# Altium schematic sheet MCU.SchDoc
size A3
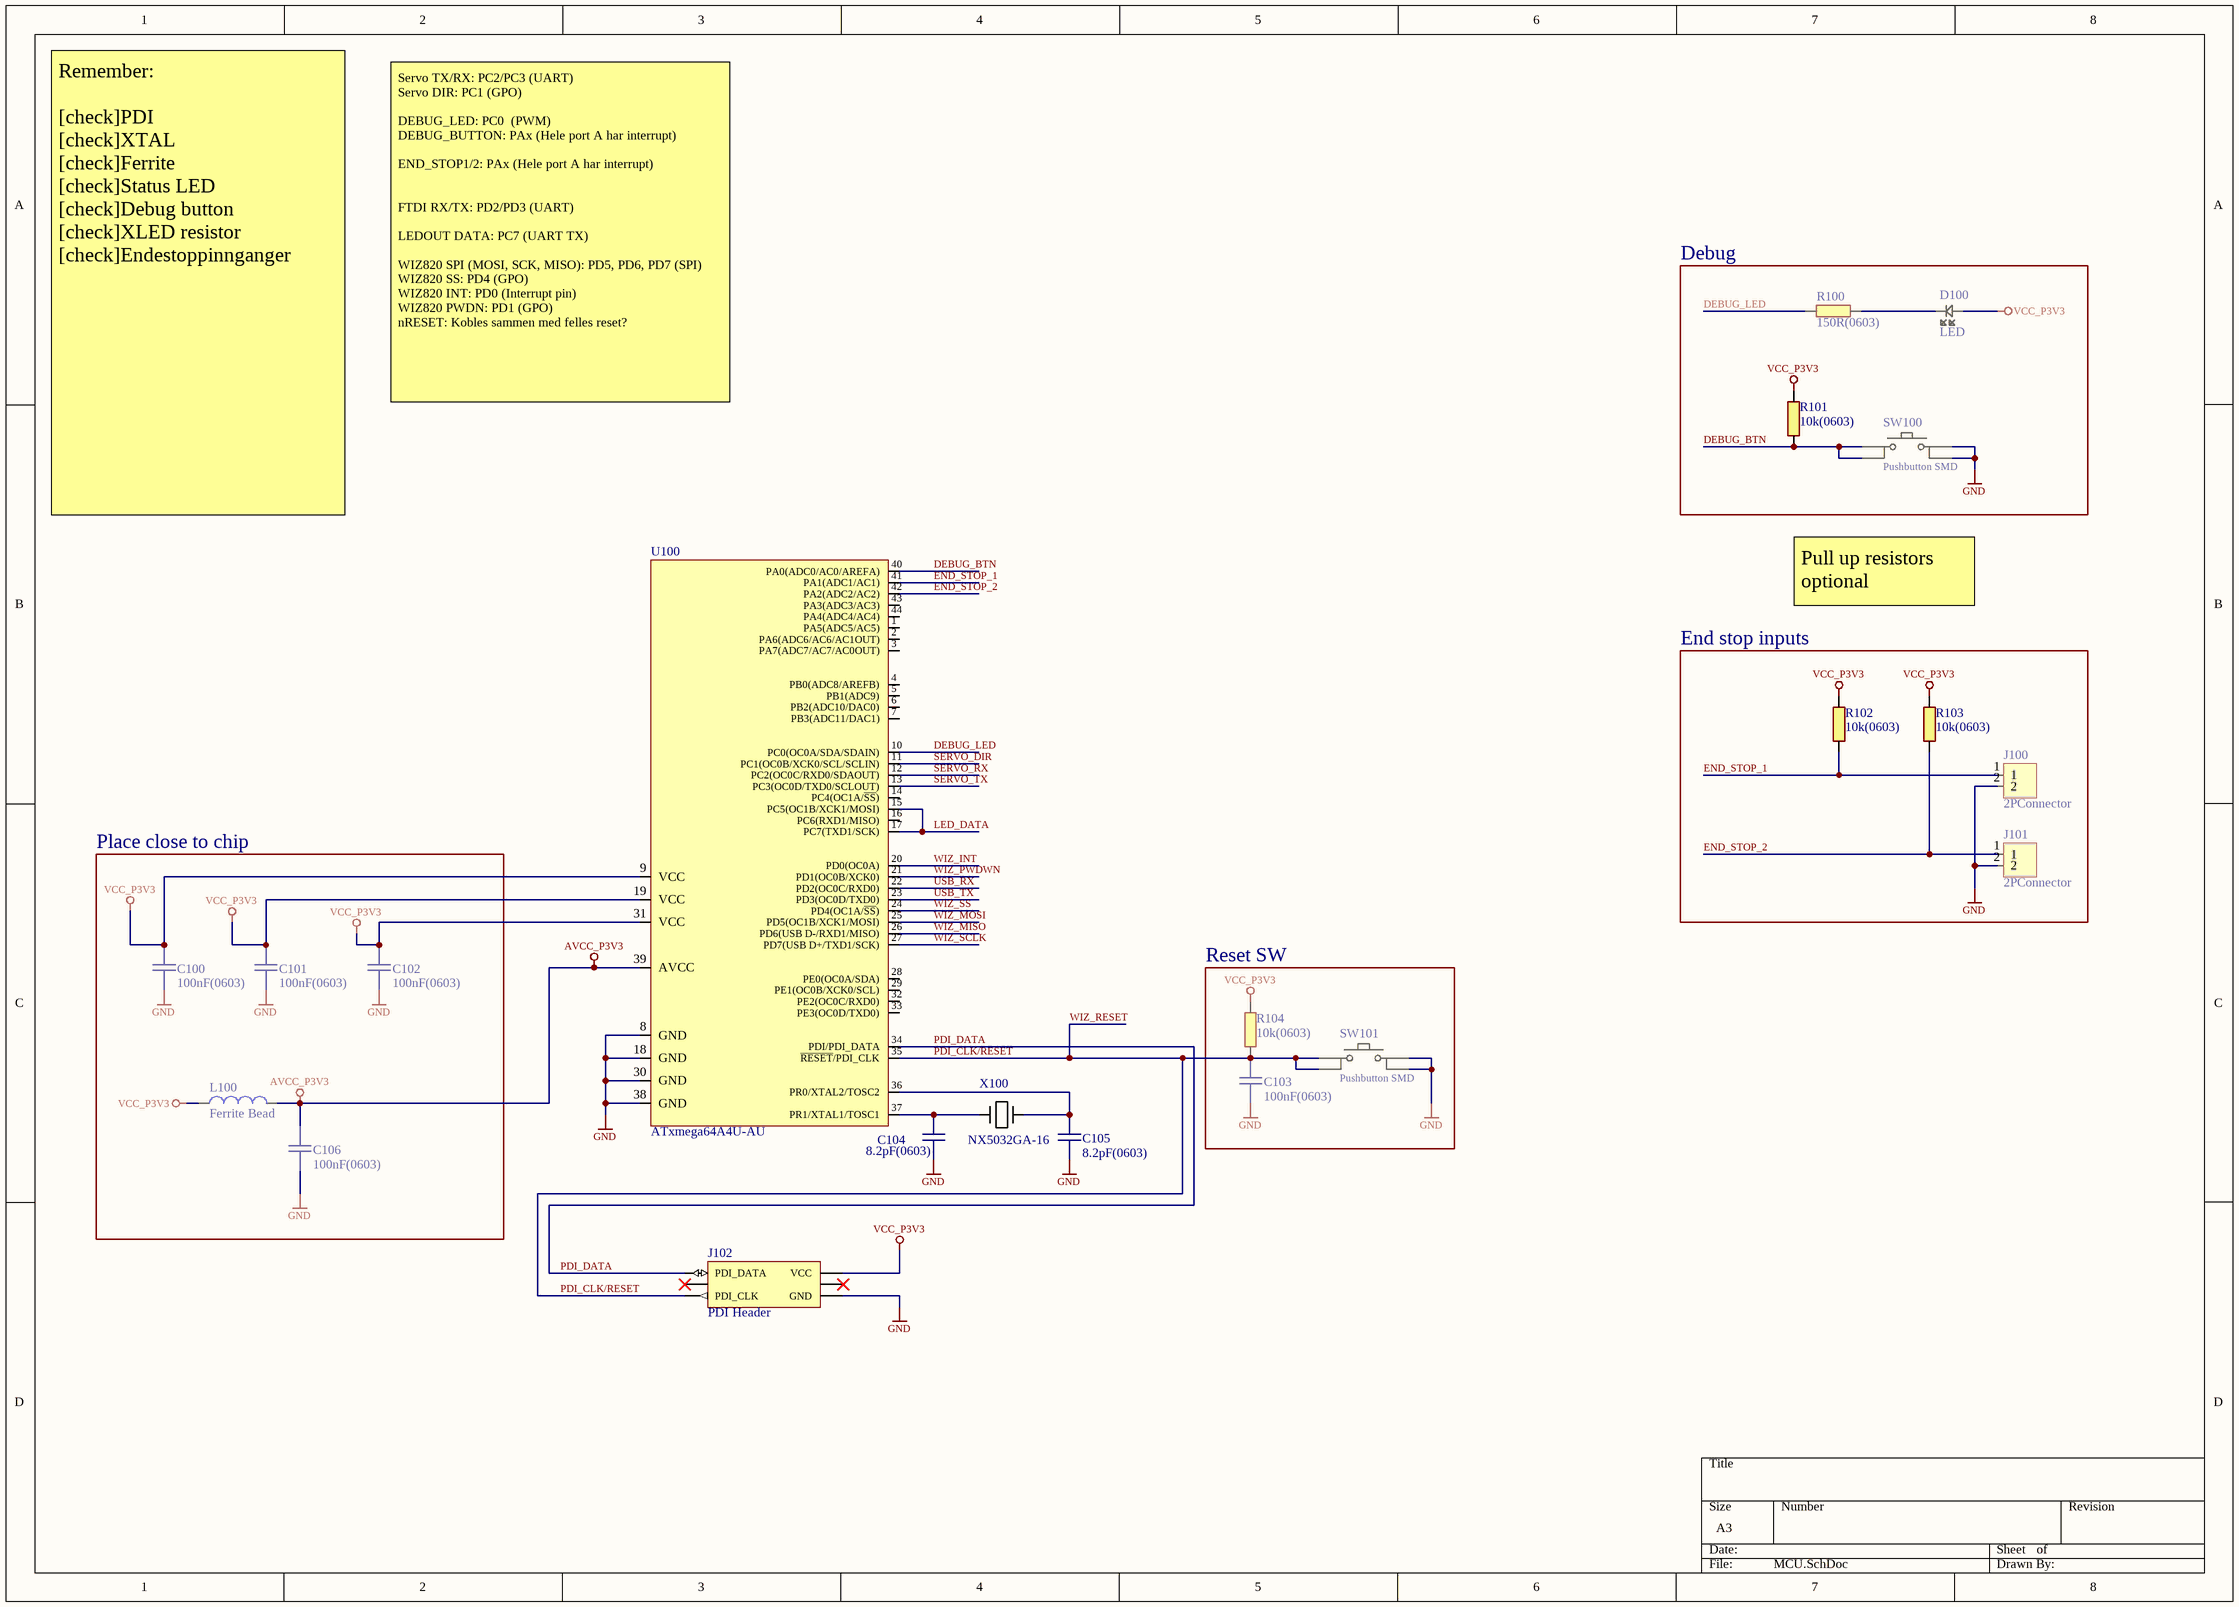
[diagram p0: MCU.SchDoc]

## Parts
C100  100nF(0603)  [CAPC0603(1608)55_N]
C101  100nF(0603)  [CAPC0603(1608)55_N]
C102  100nF(0603)  [CAPC0603(1608)55_N]
C103  100nF(0603)  [CAPC0603(1608)55_N]
C104  8.2pF(0603)  [CAPC0603(1608)55_N]
C105  8.2pF(0603)  [CAPC0603(1608)55_N]
C106  100nF(0603)  [CAPC0603(1608)55_N]
D100  LED  [I_LEDC0603(1608)_N]
J100  2PConnector  [JST_2P]
J101  2PConnector  [JST_2P]
J102  PDI Header  [HEADER_3x2]
L100  Ferrite Bead  [0603]
R100  150R(0603)  [RESC0603(1608)_N]
R101  10k(0603)  [RESC0603(1608)_N]
R102  10k(0603)  [RESC0603(1608)_N]
R103  10k(0603)  [RESC0603(1608)_N]
R104  10k(0603)  [RESC0603(1608)_N]
SW100  Pushbutton SMD  [SOIC254P500X160-4]
SW101  Pushbutton SMD  [SOIC254P500X160-4]
U100  ATxmega64A4U-AU  [44A_N]
X100  NX5032GA-16  [CRYSTAL-ABM7]

## Blocks framed on the sheet
Debug: D100 R100 R101 SW100
End stop inputs: J100 J101 R102 R103
Place close to chip: C100-C102 C106 L100
Reset SW: C103 R104 SW101

## Nets
AVCC_P3V3: C106.2 L100.2 U100.39(AVCC)
GND: C100.2 C101.2 C102.2 C103.1 C104.1 C105.1 C106.1 J100.2 J101.2 J102.6(GND) SW100.3 SW100.4 SW101.3 SW101.4 U100.8(GND) U100.18(GND) U100.30(GND) U100.38(GND)
VCC_P3V3: C100.1 C101.1 C102.1 D100.1 J102.2(VCC) L100.1 R101.2 R102.2 R103.2 R104.2 U100.9(VCC) U100.19(VCC) U100.31(VCC)
DEBUG_BTN: R101.1 SW100.1 SW100.2 U100.40(PA0(ADC0/AC0/AREFA))
DEBUG_LED: R100.1 U100.10(PC0(OC0A/SDA/SDAIN))
END_STOP_1: J100.1 R102.1 U100.41(PA1(ADC1/AC1))
END_STOP_2: J101.1 R103.1 U100.42(PA2(ADC2/AC2))
LED_DATA: U100.15(PC5(OC1B/XCK1/MOSI)) U100.17(PC7(TXD1/SCK))
PDI_CLK/RESET: C103.2 J102.5(PDI_CLK) R104.1 SW101.1 SW101.2 U100.35(~{RESET}/PDI_CLK)  [also labelled WIZ_RESET]
PDI_DATA: J102.1(PDI_DATA) U100.34(PDI/PDI_DATA)
SERVO_DIR: U100.11(PC1(OC0B/XCK0/SCL/SCLIN))
SERVO_RX: U100.12(PC2(OC0C/RXD0/SDAOUT))
SERVO_TX: U100.13(PC3(OC0D/TXD0/SCLOUT))
USB_RX: U100.22(PD2(OC0C/RXD0))
USB_TX: U100.23(PD3(OC0D/TXD0))
WIZ_INT: U100.20(PD0(OC0A))
WIZ_MISO: U100.26(PD6(USB_D-/RXD1/MISO))
WIZ_MOSI: U100.25(PD5(OC1B/XCK1/MOSI))
WIZ_PWDWN: U100.21(PD1(OC0B/XCK0))
WIZ_SCLK: U100.27(PD7(USB_D+/TXD1/SCK))
WIZ_SS: U100.24(PD4(OC1A/~{SS}))
NetC104_2: C104.2 U100.37(PR1/XTAL1/TOSC1) X100.1
NetC105_2: C105.2 U100.36(PR0/XTAL2/TOSC2) X100.2
NetD100_2: D100.2 R100.2

Not connected (* = marked no-connect by the designer): J102 3* 4*; U100 1(PA5(ADC5/AC5)) 2(PA6(ADC6/AC6/AC1OUT)) 3(PA7(ADC7/AC7/AC0OUT)) 4(PB0(ADC8/AREFB)) 5(PB1(ADC9)) 6(PB2(ADC10/DAC0)) 7(PB3(ADC11/DAC1)) 14(PC4(OC1A/~{SS})) 16(PC6(RXD1/MISO)) 28(PE0(OC0A/SDA)) 29(PE1(OC0B/XCK0/SCL)) 32(PE2(OC0C/RXD0)) 33(PE3(OC0D/TXD0)) 43(PA3(ADC3/AC3)) 44(PA4(ADC4/AC4))

## Notes on the sheet
- Servo TX/RX: PC2/PC3 (UART)
  Servo DIR: PC1 (GPO)
  DEBUG_LED: PC0 	(PWM)
  DEBUG_BUTTON: PAx (Hele port A har interrupt)
  END_STOP1/2: PAx (Hele port A har interrupt)
  FTDI RX/TX: PD2/PD3 (UART)
  LEDOUT DATA: PC7 (UART TX)
  WIZ820 SPI (MOSI, SCK, MISO): PD5, PD6, PD7 (SPI)
  WIZ820 SS: PD4 (GPO)
  WIZ820 INT: PD0 (Interrupt pin)
  WIZ820 PWDN: PD1 (GPO)
  nRESET: Kobles sammen med felles reset?
- Remember:
  [check]PDI
  [check]XTAL
  [check]Ferrite
  [check]Status LED
  [check]Debug button
  [check]XLED resistor
  [check]Endestoppinnganger
- Pull up resistors optional

## Library data of the parts
C100-C103 C106 = 100nF(0603): 100nF 0603 5% X7R 50V; pakke_opprettet_av: 815; pris: 1; nokkelord: Kondensator, Capacitor, CAP; pakketype: 93; id: 3028; navn: 100nF(0603); pakke_opprettet: 18.02.2015 14:18:13; symbol_opprettet_av: 815; symbol_opprettet: 14.11.2014 20:19:34
C104 C105 = 8.2pF(0603): 0603 5% NP0 50V; pakke_opprettet_av: 815; pris: 1; nokkelord: Kondensator, Capacitor, CAP; pakketype: 93; id: 3032; navn: 8.2pF(0603); pakke_opprettet: 18.02.2015 14:18:13; symbol_opprettet_av: 815; symbol_opprettet: 14.11.2014 20:19:34
D100 = SMD LED Red: SMD; rad: 0; rom: OV; lager_type: Fremlager; dybde: 2; hylle: 13; antall: 50; pakke_opprettet_av: 815; leverandor_varenr: 8554641; pris: 1; pakketype: 93; produsent: Avago; leverandor: Farnell; id: 2209; navn: SMD LED Red; kolonne: 0; pakke_opprettet: 06.07.2014 18:55:44; symbol_opprettet_av: 815; symbol_opprettet: 06.07.2014 18:59:47; nokkelord: SMD
J100 J101 = JST 2pin: pris pr. stk.; pakke_opprettet_av: 815; pris: 2; nokkelord: Connector, Kontakt; pakketype: 92; id: 2227; navn: JST 2pin; pakke_opprettet: 28.06.2014 18:25:03; symbol_opprettet_av: 815; symbol_opprettet: 28.06.2014 15:33:17
J102 = PDI-HEADER: PDI Xmega programming header; pakke_opprettet_av: 774; leverandor_varenr: Derp; pris: 3; pakketype: 92; produsent: OV; leverandor: Farnell; id: 2407; navn: PDI-HEADER; pakke_opprettet: 23.08.2014 13:37:50; symbol_opprettet_av: 774; symbol_opprettet: 23.08.2014 13:38:30; nokkelord: PDI Xmega programming
L100 = BLM18SG331TN1D: Ferrite Bead 0603; Farnell: 1515756RL; MPN: BLM18SG331TN1D; Digi-Key: 490-3997-1-ND
R100 = 3031: 0603 0.1W 1% Thick film resistor; id: 3031; pakke_opprettet_av: 815; symbol_opprettet_av: oystesm; pris: 0; nokkelord: Motstand, Resistor; pakketype: 93; produsent: Multikomp; pakke_opprettet: 08.07.2014 21:15:30; symbol_opprettet: 08.07.2014 21:16:33; navn: 150R(0603)
R101-R104 = 2444: 10k 0603 0.1W 1% Thick film resistor; id: 2444; rad: -1; rom: OV; lager_type: Fremlager; dybde: 72; hylle: 6; antall: 100; kolonne: 0; pakke_opprettet_av: 815; symbol_opprettet_av: oystesm; nokkelord: Resistor Motstand; pakketype: 93; pakke_opprettet: 08.07.2014 21:15:30; symbol_opprettet: 08.07.2014 21:16:33; navn: 10k(0603); pris: 0
SW100 SW101 = Pushbutton SMD: Momentary tactile pushbutton SMD; rad: 3; rom: OV; lager_type: Fremlager; dybde: 2; hylle: 7; antall: 100; pakke_opprettet_av: 815; nokkelord: smd, tactile, pushbutton, knapp, smd; pakketype: 101; id: 2413; navn: Pushbutton SMD; kolonne: 3; pakke_opprettet: 14.11.2014 22:12:31; symbol_opprettet_av: 815; symbol_opprettet: 14.11.2014 21:57:30; pris: 2
U100 = ATxmega64A4U-AU: 8/16-bit AVR XMEGA A4U Microcontroller, 1.6-3.6V, 64KB + 4KB Flash; PackageReference: 44A; PackageDescription: 44-Pin Plastic Thin Profile Quad Flat Pack, 10 x 10 x 1.0 mm Body, 0.8 mm Pitch (TQFP)
X100 = NX5032GA-16: Crystal 16 MHz; rad: 0; rom: OV; lager_type: Fremlager; dybde: 1; hylle: 2; antall: 42; kolonne: 3; pakke_opprettet_av: 774; leverandor_varenr: 644-1135-1-ND; pris: 5; nokkelord: xtal, oscillator; pakketype: 101; produsent: NDK; leverandor: DigiKey; id: 1594; navn: NX5032GA-16; pakke_opprettet: 23.08.2014 20:10:40; symbol_opprettet_av: 774; symbol_opprettet: 23.08.2014 20:23:20